# Altium schematic sheet Sheet2.SchDoc
size A; SheetNumber: 1; SheetTotal: 1
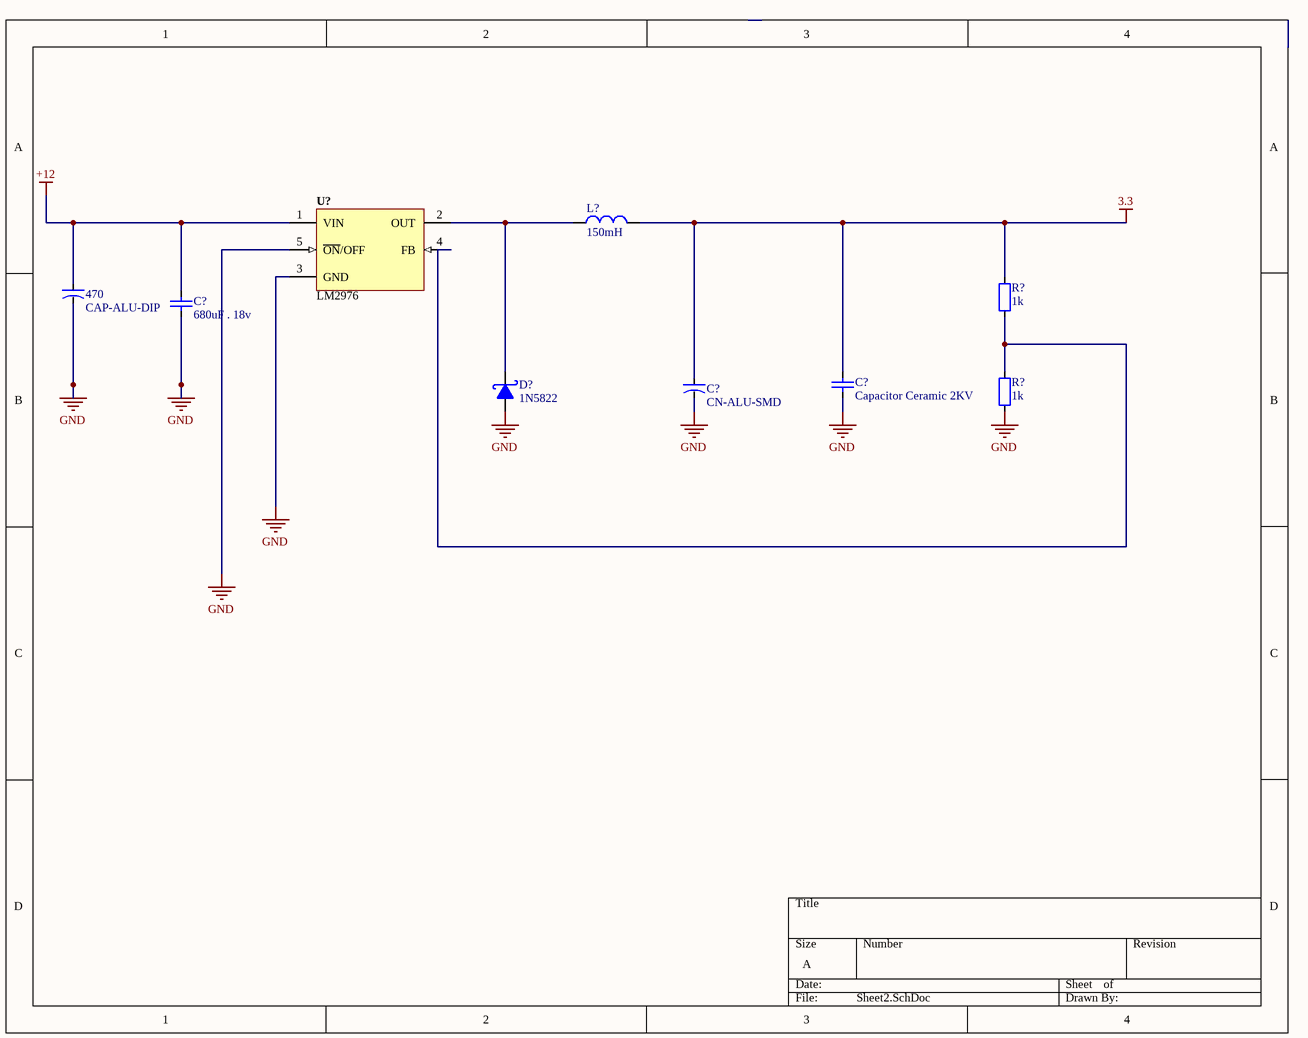
[diagram p0: Sheet2.SchDoc]

## Parts
(Parts that share a designator on the sheet are numbered #1, #2 ... from top to bottom, then left to right.)
470  CAP-ALU-DIP  [CA-ALU-2.54]
C?#1  680uF . 18v  [CAP_0402]
C?#2  CN-ALU-SMD  [CAP-ALU-SMD-4.5x5x1.4]
C?#3  Capacitor Ceramic 2KV  [103/2KV]
D?  1N5822  [SMA]
L?  150mH  [L-SMD-M-12x10]
R?#1  1k  [RES-1/2W]
R?#2  1k  [RES-1/2W]
U?  LM2976  [TO263]

## Nets
3.3: C?#2.1 C?#3.2 L?.2 R?#1.2
+12: 470.1 C?#1.2 U?.1(VIN)
GND: 470.2 C?#1.1 C?#2.2 C?#3.1 D?.1(A) R?#2.1 U?.3(GND) U?.5(~{ON}/OFF)
NetD?_2: D?.2(K) L?.1 U?.2(OUT)
NetR?#1_1: R?#1.1 R?#2.2 U?.4(FB)

## Library data of the parts
470 = CAP-ALU-DIP: Capacitor (Semiconductor SIM Model); Value: 104; LatestRevisionDate: 17-Jul-2002; LatestRevisionNote: Re-released for DXP Platform.; PackageReference: C1206; Publisher: Altium Limited
C?#1 = CapSMD: Capacitor; Value: 33p; Published: 8-Jun-2000; LatestRevisionDate: 17-Jul-2002; LatestRevisionNote: Re-released for DXP Platform.; PackageReference: RAD-0.3; Publisher: Altium Limited
C?#2 = CAP-ALU-SMD: Polarized Capacitor (Axial); Published: 8-Jun-2000; LatestRevisionDate: 17-Jul-2002; LatestRevisionNote: Re-released for DXP Platform.; PackageReference: POLAR0.8; Publisher: Altium Limited
C?#3 = Cap2KV: Published: 8-Jun-2000; LatestRevisionDate: 17-Jul-2002; LatestRevisionNote: Re-released for DXP Platform.; PackageReference: RAD-0.3; Publisher: Altium Limited
D? = 1N5822: Schottky Rectifiers; Value: Diode c?m 1N5408
L? = Inductor: Value: 150 mH
R?#1 R?#2 = Resistor - DIP: Value: R1/4W - 1K
U? = LM2596: Max Input Voltage: 12 V; Max Output Current: 3 (6.0 peak) A; Max Output Voltage: mV; Category: IC-Power; Min Input Voltage: mV; Min Output Voltage: mV; Mounting Technology: Surface Mount; Status: Unreleased; Supply Voltage: mV; Temperature Range: -40 to +125 degC